# EAGLE design TeamB (EAGLE 6.5.0)
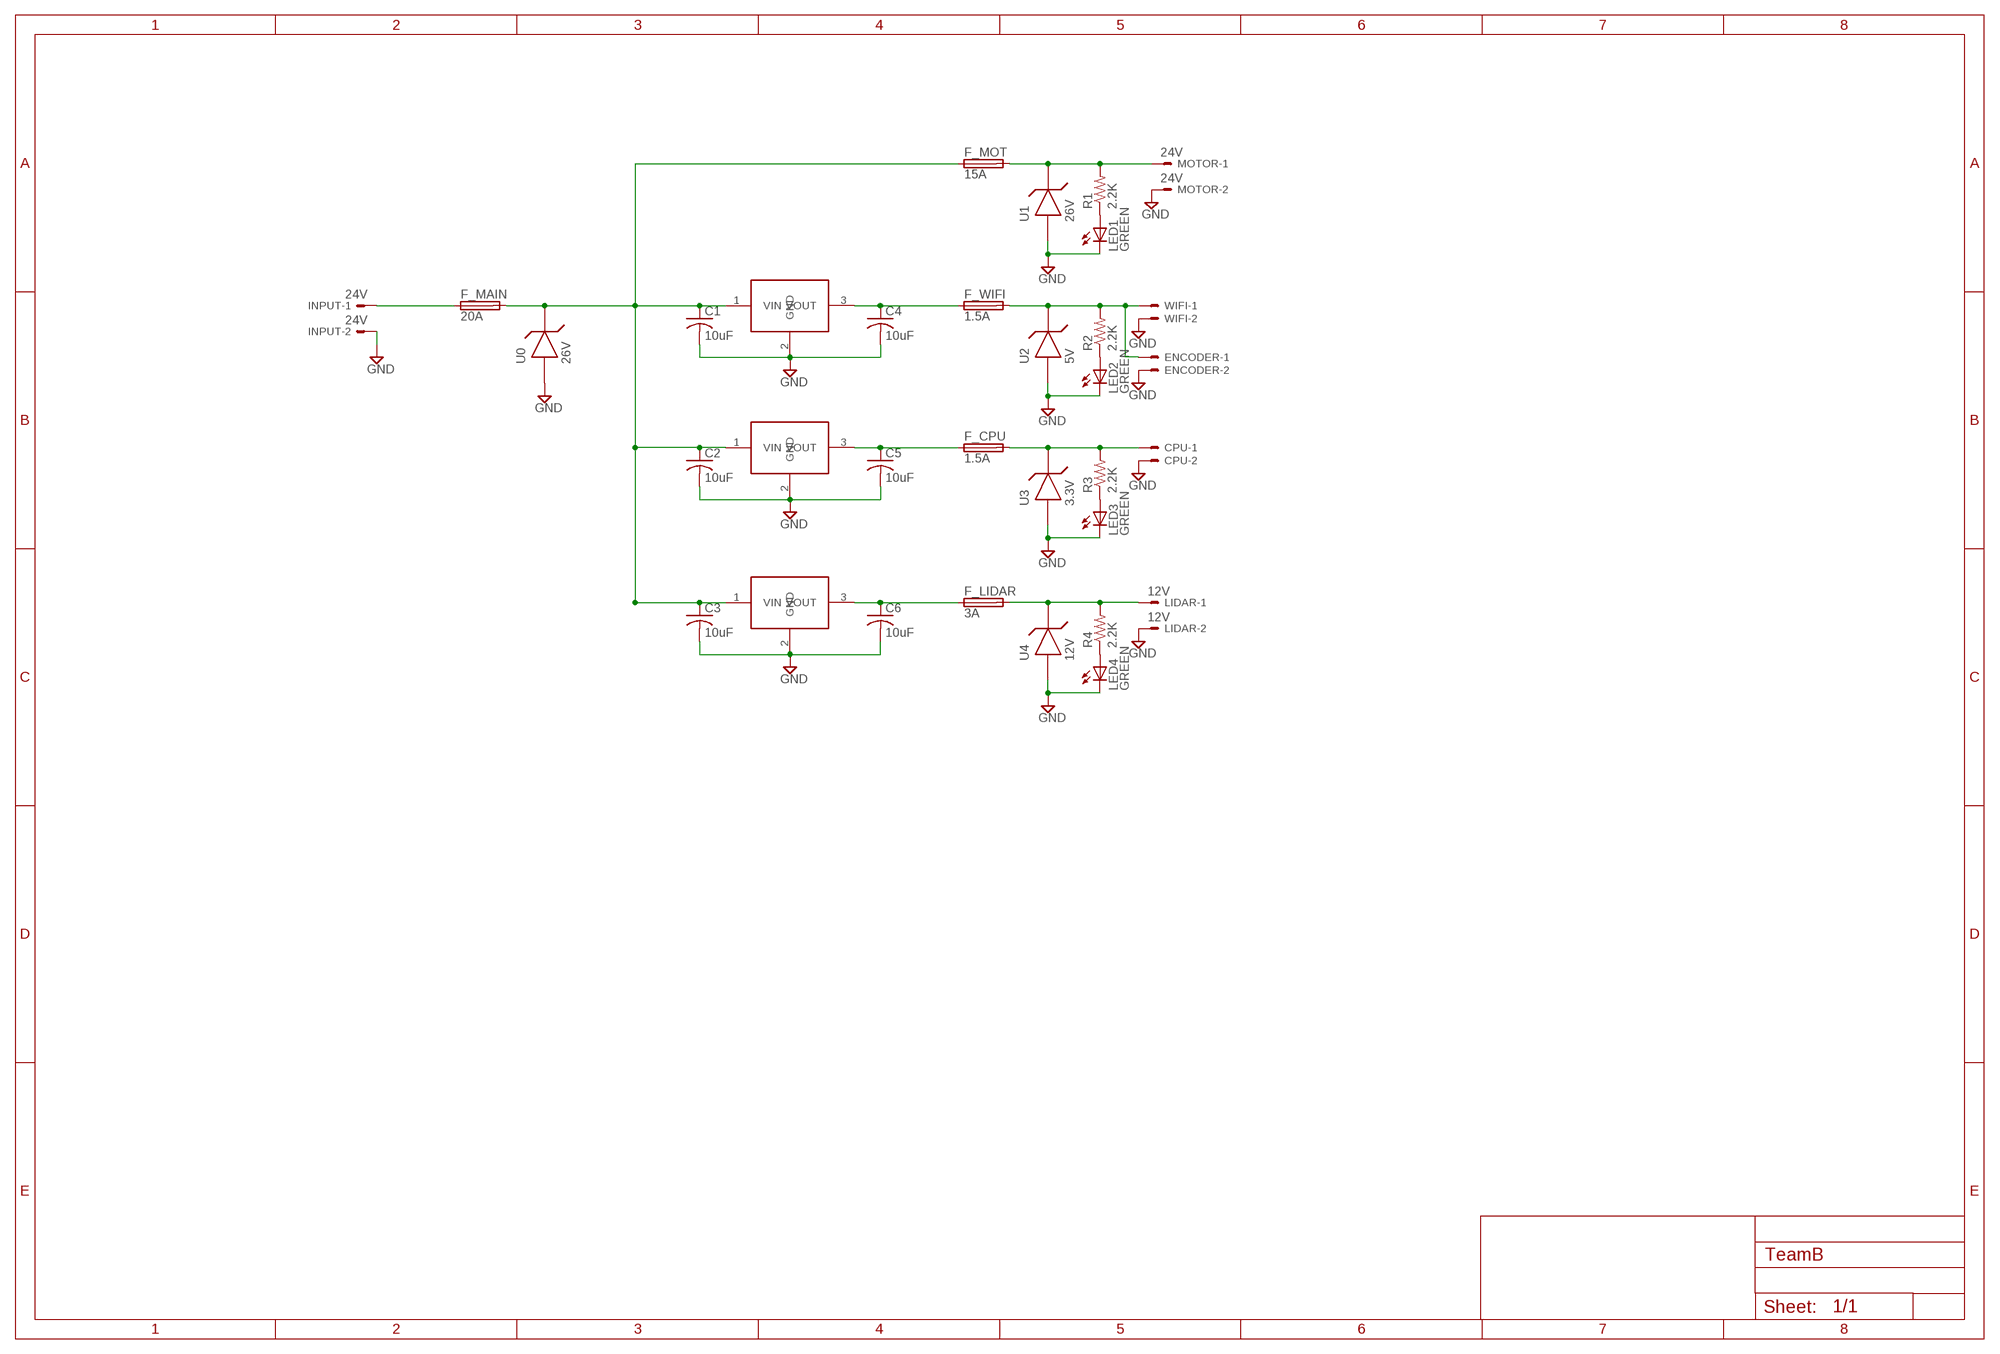
[diagram p0: schematic, sheet 1]

## Parts
C1  10uF  C-USC1206  [C1206]
C2  10uF  C-USC1206  [C1206]
C3  10uF  C-USC1206  [C1206]
C4  10uF  C-USC1206  [C1206]
C5  10uF  C-USC1206  [C1206]
C6  10uF  C-USC1206  [C1206]
CPU  3.3V  C-GRID-02-70553  [70553-02]
ENCODER  5V  C-GRID-02-70553  [70553-02]
F_CPU  1.5A  TE5  [TE5]
F_LIDAR  3A  TE5  [TE5]
F_MAIN  20A  TE5  [TE5]
F_MOT  15A  TE5  [TE5]
F_WIFI  1.5A  TE5  [TE5]
INPUT  24V  5566-2  [5566-2]
LED1  GREEN  LEDSML1206  [SML1206]
LED2  GREEN  LEDSML1206  [SML1206]
LED3  GREEN  LEDSML1206  [SML1206]
LED4  GREEN  LEDSML1206  [SML1206]
LIDAR  12V  5566-2  [5566-2]
MOTOR  24V  5566-2  [5566-2]
Q1  MIC29300-5.0WU  MIC29150/29300/29500  [TO220]
Q2  MIC29300-3.3WU  MIC29150/29300/29500  [TO220]
Q3  MIC29300-12WU  MIC29150/29300/29500  [TO220]
R1  2.2K  R-US_R1206  [R1206]
R2  2.2K  R-US_R1206  [R1206]
R3  2.2K  R-US_R1206  [R1206]
R4  2.2K  R-US_R1206  [R1206]
U0  26V  TVS-DIODE-SMA  [SMA]
U1  26V  TVS-DIODE-SMA  [SMA]
U2  5V  TVS-DIODE-SMA  [SMA]
U3  3.3V  TVS-DIODE-SMB  [SMB]
U4  12V  TVS-DIODE-SMA  [SMA]
WIFI  5V  C-GRID-02-70553  [70553-02]

## Nets
GND: C1.2 C2.2 C3.2 C4.2 C5.2 C6.2 CPU.2 ENCODER.2 INPUT.2 LED1.C LED2.C LED3.C LED4.C LIDAR.2 MOTOR.2 Q1.2(GND) Q2.2(GND) Q3.2(GND) U0.AN U1.AN U2.AN U3.AN U4.AN WIFI.2
N$1: F_MOT.2 MOTOR.1 R1.2 U1.CAT
N$2: F_LIDAR.2 LIDAR.1 R4.2 U4.CAT
N$3: C5.1 F_CPU.1 Q2.3(VOUT)
N$4: CPU.1 F_CPU.2 R3.2 U3.CAT
N$5: LED1.A R1.1
N$6: C4.1 F_WIFI.1 Q1.3(VOUT)
N$7: ENCODER.1 F_WIFI.2 R2.2 U2.CAT WIFI.1
N$8: LED2.A R2.1
N$9: C6.1 F_LIDAR.1 Q3.3(VOUT)
N$10: F_MAIN.1 INPUT.1
N$11: LED3.A R3.1
N$12: C1.1 C2.1 C3.1 F_MAIN.2 F_MOT.1 Q1.1(VIN) Q2.1(VIN) Q3.1(VIN) U0.CAT
N$13: LED4.A R4.1

## Library data of the parts
C1-C6 = rcl:C-US: CAPACITOR, American symbol
CPU ENCODER WIFI = con-molex:C-GRID-02: CONNECTOR wire to board 2.54 mm (0.100") pitch header; OC_FARNELL: unknown; OC_NEWARK: unknown
F_CPU F_LIDAR F_MAIN F_MOT F_WIFI = fuse:TE5: FUSE Wickmann; OC_FARNELL: unknown; OC_NEWARK: unknown
INPUT LIDAR MOTOR = con-molex:5566-2: Mini FIT connector 2 pol Source: http://www.molex.com; OC_FARNELL: 1822072; OC_NEWARK: unknown
LED1-LED4 = led:LED: LED OSRAM: - CHIPLED LG R971, LG N971, LY N971, LG Q971, LY Q971, LO R971, LY R971 LH N974, LH R974 LS Q976, LO Q976, LY Q976 LO Q996 - Hyper CHIPLED LW Q18S LB Q993, LB Q99A, LB R99A - SideLED LS A670, LO A670, LY A670, LG A670, LP A670 LB A673, LV A673, LT A673, LW A673 LH A674 LY A675 LS A676, LA A676, LO A676, LY A676, LW A676 LS A679, LY A679, LG A679 - Hyper Micro SIDELED® LS Y876, LA Y876, LO Y876, LY Y876 LT Y87S - SmartLED LW L88C, LW L88S LB L89C, LB L89S, LG L890 LS L89K, LO L89K, LY L89K LS L896, LA L896, LO L896, LY L896 - TOPLED LS T670, LO T670, LY T670, LG T670, LP T670 LSG T670, LSP T670, LSY T670, LOP T670, LYG T670 LG T671, LOG T671, LSG T671 LB T673, LV T673, LT T673, LW T673 LH T674 LS T676, LA T676, LO T676, LY T676, LB T676, LH T676, LSB T676, LW T676 LB T67C, LV T67C, LT T67C, LS T67K, LO T67K, LY T67K, LW E67C LS E67B, LA E67B, LO E67B, LY E67B, LB E67C, LV E67C, LT E67C LW T67C LS T679, LY T679, LG T679 LS T770, LO T770, LY T770, LG T770, LP T770 LB T773, LV T773, LT T773, LW T773 LH T774 LS E675, LA E675, LY E675, LS T675 LS T776, LA T776, LO T776, LY T776, LB T776 LHGB T686 LT T68C, LB T68C - Hyper Mini TOPLED® LB M676 - Mini TOPLED Santana® LG M470 LS M47K, LO M47K, LY M47K Source: http://www.osram.convergy.de LUXEON: - LUMILED® LXK2-PW12-R00, LXK2-PW12-S00, LXK2-PW14-U00, LXK2-PW14-V00 LXK2-PM12-R00, LXK2-PM12-S00, LXK2-PM14-U00 LXK2-PE12-Q00, LXK2-PE12-R00, LXK2-PE12-S00, LXK2-PE14-T00, LXK2-PE14-U00 LXK2-PB12-K00, LXK2-PB12-L00, LXK2-PB12-M00, LXK2-PB14-N00, LXK2-PB14-P00, LXK2-PB14-Q00 LXK2-PR12-L00, LXK2-PR12-M00, LXK2-PR14-Q00, LXK2-PR14-R00 LXK2-PD12-Q00, LXK2-PD12-R00, LXK2-PD12-S00 LXK2-PH12-R00, LXK2-PH12-S00 LXK2-PL12-P00, LXK2-PL12-Q00, LXK2-PL12-R00 Source: www.luxeon.com KINGBRIGHT: KA-3528ASYC Source: www.kingbright.com
Q1-Q3 = Task5:MIC29150/29300/29500
R1-R4 = rcl:R-US_: RESISTOR, American symbol
U0 U1-U4 = Task5:TVS-DIODE: TVS Diode Symbol for use in task 6

## Board
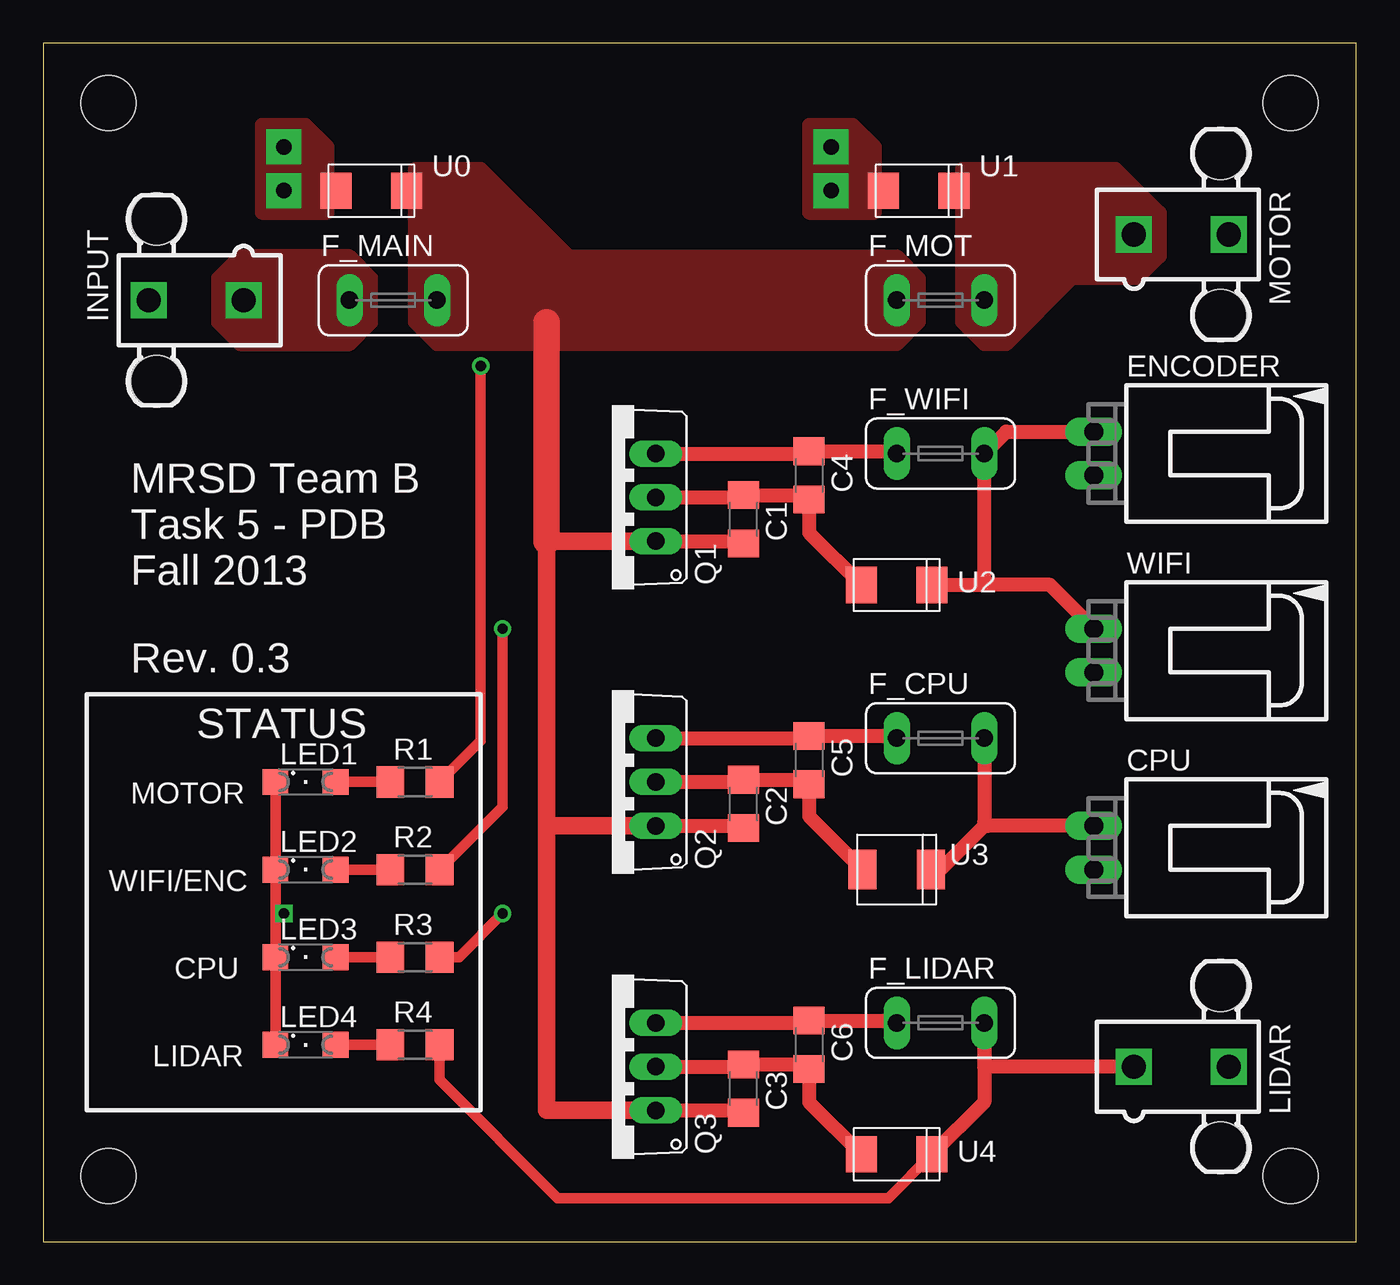
[diagram p1: board, top side]
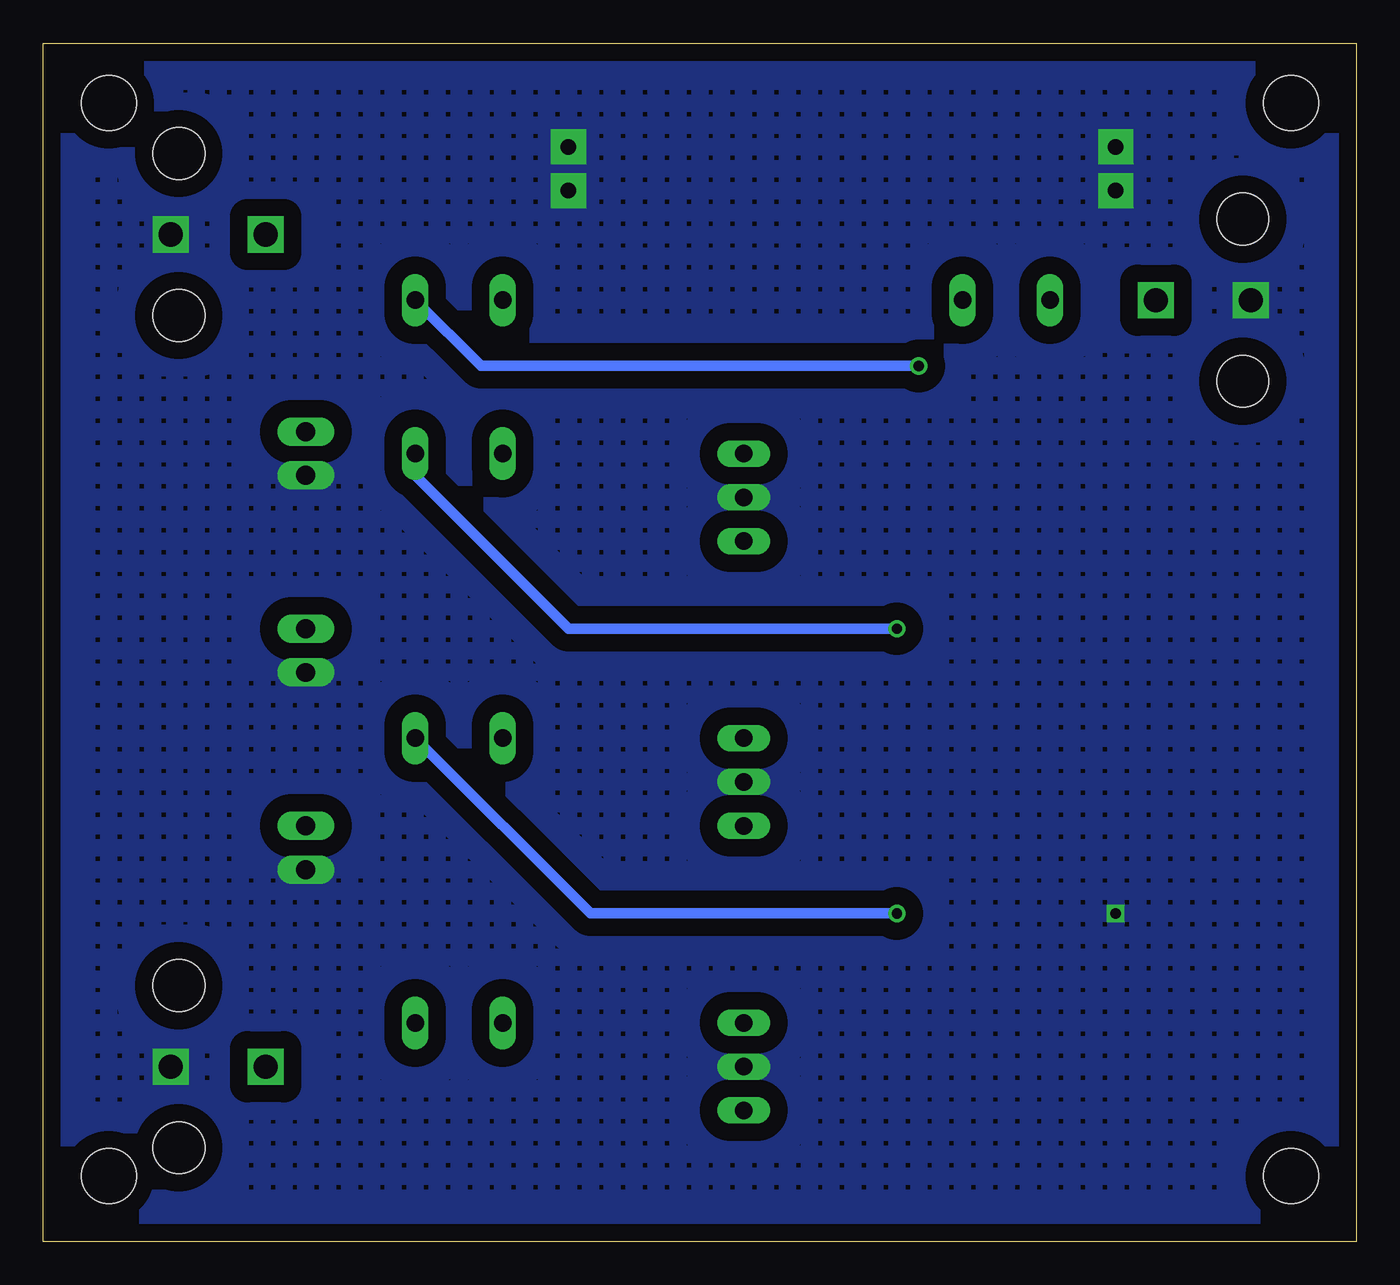
[diagram p2: board, bottom side, seen from below]

Size 76.19 x 69.52 mm. Coordinates in mm from the lower left corner, seen from the top.
Outline: 76.19,0 76.19,69.52 0,69.52 0,0 76.19,0
Copper layers (1*16): Top 0.035mm / dielectric 1.5mm / Bottom 0.035mm
Design rules "default *": minimum track width 24mil, minimum drill 20mil, track to track 8mil, track to pad 8mil, pad to pad 8mil, via to via 8mil, smd to smd 8mil, copper to edge 40mil, drill to drill 8mil, minimum pad ring 10mil, minimum via ring 8mil, stop-mask expansion 4mil, vias tented up to drill 0mil, thermal gap 10mil
Holes 3.17 mm at 3.8,66.04 3.8,3.81 72.38,3.81 72.38,66.04

### Footprints (pad centres in the part's own frame; a part is rotated, then mirrored left to right if it is on the bottom)
C1206 = smd 1.6 x 1.8: 1 -1.4,0; 2 1.4,0
70553-02 = drill 1.092 long: 1 -1.27,-7.62; 2 1.27,-7.62
TE5 = drill 1.016 long: 1 -2.54,0; 2 2.54,0
5566-2 = drill 1.4 square: 1 0,-2.75; 2 0,2.75 | hole 3: 4.7,2.29; -4.7,2.29
SML1206 = smd 1.5 x 1.5: A 1.75,0; C -1.75,0
TO220 = drill 1.016 long: 1 -2.54,-2.54; 2 0,-2.54; 3 2.54,-2.54
R1206 = smd 1.6 x 1.803: 1 -1.422,0; 2 1.422,0
SMA = smd 1.8 x 2.1: AN 2.05,0; CAT -2.05,0
SMB = smd 1.626 x 2.286: AN 1.981,0; CAT -1.981,0

### Placement (x,y rotation side)
C1  40.63,41.91 90 top
C2  40.63,25.4 90 top
C3  40.63,8.89 90 top
C4  44.44,44.45 270 top
C5  44.44,27.94 270 top
C6  44.44,11.43 270 top
CPU  68.57,22.86 270 top
ENCODER  68.57,45.72 270 top
F_CPU  52.06,29.21 0 top
F_LIDAR  52.06,12.7 0 top
F_MAIN  20.31,54.61 0 top
F_MOT  52.06,54.61 0 top
F_WIFI  52.06,45.72 0 top
INPUT  8.88,54.61 90 top
LED1  15.23,26.67 0 top
LED2  15.23,21.59 0 top
LED3  15.23,16.51 0 top
LED4  15.23,11.43 0 top
LIDAR  66.03,10.16 270 top
MOTOR  66.03,58.42 270 top
Q1  33.01,43.18 90 top
Q2  33.01,26.67 90 top
Q3  33.01,10.16 90 top
R1  21.58,26.67 0 top
R2  21.58,21.59 0 top
R3  21.58,16.51 0 top
R4  21.58,11.43 0 top
U0  19.04,60.96 180 top
U1  50.79,60.96 180 top
U2  49.52,38.1 180 top
U3  49.52,21.59 180 top
U4  49.52,5.08 180 top
WIFI  68.57,34.29 270 top

### Tracks (layer width: path | path; a pad name or v marks a point on that pad's centre or on a via)
GND  (via drill 0.6 pad 0.81, 0.9 pad 2.03)
  Top 0.61: LED1.C LED2.C 13.48,19.05 | 13.48,19.05 LED3.C LED4.C | 13.48,19.05 v13.96,19.05
  Top 0.813: Q1.2 40.5,43.18 C1.2 44.18,43.31 C4.2 44.44,41.13 U2.AN | Q2.2 40.5,26.67 C2.2 44.18,26.8 C5.2 44.44,24.69 U3.AN | Q3.2 40.5,10.16 C3.2 44.18,10.29 C6.2 44.44,8.11 U4.AN
  other vias: 45.71,60.96 13.96,60.96 13.96,63.5 45.71,63.5
  pour Bottom (isolate 1.016, no thermals, hatched): 1.26,68.58 74.92,68.58 74.92,1.27 1.26,1.27
  pour Top (no thermals): 13.96,59.69 16.5,59.69 16.5,63.5 15.23,64.77 12.69,64.77 12.69,59.69
  pour Top (no thermals): 45.71,59.69 48.25,59.69 48.25,63.5 46.98,64.77 44.44,64.77 44.44,59.69
N$1  (via drill 0.6 pad 0.81)
  Top 0.61: v25.39,50.8 25.39,29.06 R1.2
  Bottom 0.61: v25.39,50.8 50.79,50.8 F_MOT.2
  pour Top (no thermals): 54.6,52.07 53.33,53.34 53.33,62.23 62.22,62.23 64.76,59.69 64.76,57.15 63.49,55.88 59.68,55.88 55.87,52.07
N$2
  Top 0.61: U4.CAT 49.03,2.54 29.85,2.54 23,9.39 R4.2
  Top 0.813: U4.CAT 54.6,8.11 F_LIDAR.2 54.6,10.16 LIDAR.1
N$3
  Top 0.813: Q2.3 44.31,29.21 C5.1 49.39,29.34 F_CPU.1
N$4  (via drill 0.6 pad 0.81)
  Top 0.61: v26.66,19.05 24.12,16.51 R3.2
  Top 0.813: CPU.1 54.78,24.13 54.69,24.22 | F_CPU.2 54.6,24.31 54.69,24.22 | U3.CAT 52.06,21.59 54.69,24.22
  Bottom 0.61: v26.66,19.05 44.44,19.05 F_CPU.2
N$5
  Top 0.61: LED1.A R1.1
N$6
  Top 0.813: Q1.3 44.31,45.72 C4.1 49.39,45.85 F_WIFI.1
N$7  (via drill 0.6 pad 0.81)
  Top 0.61: v26.66,35.56 26.66,25.25 R2.2
  Top 0.813: ENCODER.1 55.87,46.99 F_WIFI.2 54.6,38.1 | WIFI.1 58.41,38.1 54.6,38.1 | U2.CAT 54.6,38.1
  Bottom 0.61: v26.66,35.56 45.71,35.56 54.6,44.45 F_WIFI.2
N$8
  Top 0.61: R2.1 LED2.A
N$9
  Top 0.813: Q3.3 44.31,12.7 C6.1 49.39,12.83 F_LIDAR.1
N$10
  pour Top (no thermals): 10.15,55.88 10.15,53.34 11.42,52.07 17.77,52.07 19.04,53.34 19.04,55.88 17.77,57.15 11.42,57.15
N$11
  Top 0.61: R3.1 LED3.A
N$12
  Top 0.813: Q1.1 40.5,40.64 C1.1 | Q2.1 40.5,24.13 C2.1 | Q3.1 40.5,7.62 C3.1
  Top 1.016: Q3.1 29.2,7.62 29.2,24.13 | 29.2,24.13 29.2,40.64 Q1.1 | Q2.1 29.2,24.13
  Top 1.524: 29.2,40.64 29.2,53.34
  pour Top (no thermals): 22.85,52.07 21.58,53.34 21.58,62.23 25.39,62.23 30.47,57.15 49.52,57.15 50.79,55.88 50.79,53.34 49.52,52.07
N$13
  Top 0.61: R4.1 LED4.A

### Text on the board
tNames: MRSD Team B / Task 5 - PDB / Fall 2013 | Rev. 0.3 | STATUS | MOTOR | WIFI/ENC | CPU | LIDAR